# Altium schematic sheet XMOS_TSBOARD_Top.SchDoc
size A3; DocumentNumber: 1; SheetNumber: 1; SheetTotal: 8
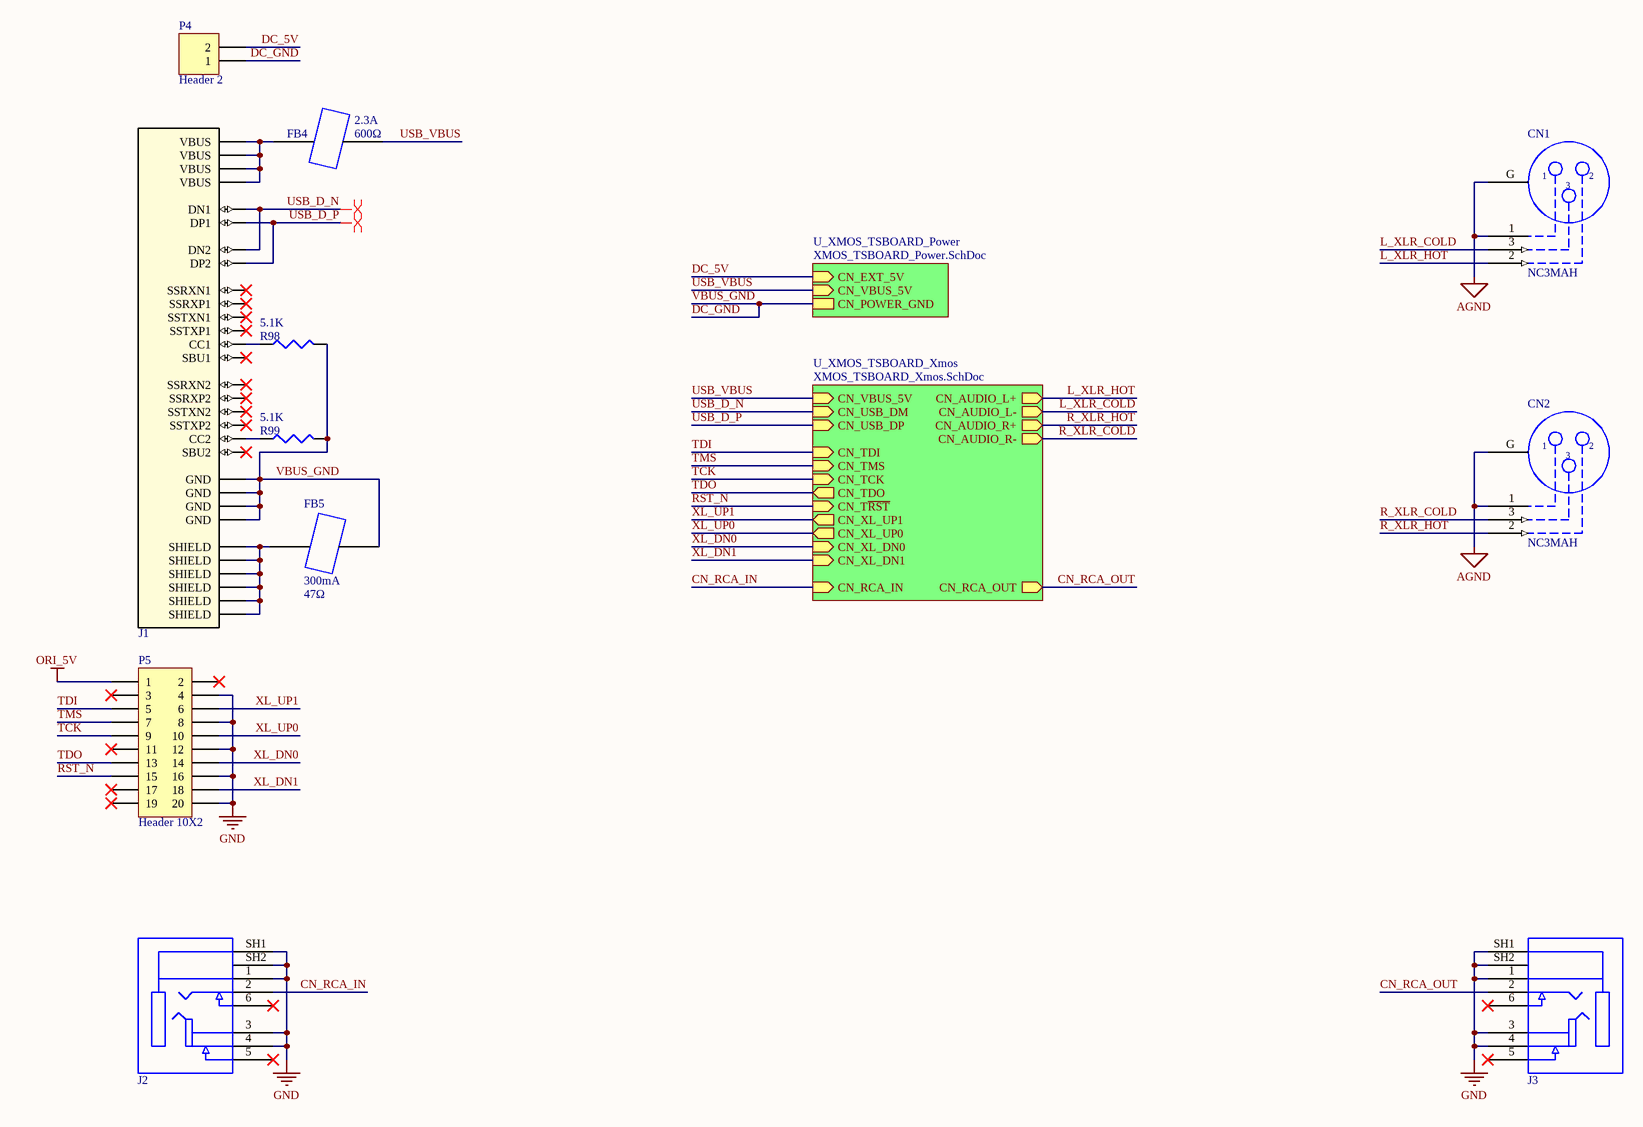
[diagram p0: XMOS_TSBOARD_Top.SchDoc]

## Parts
CN1  NC3MAH  [NC3MAH]
CN2  NC3MAH  [NC3MAH]
FB4  RatedCurrent: 2.3A  Impedance(100MHz): 600Ω  [0805]  (hidden comment: FerriteBeads)
FB5  RatedCurrent: 300mA  Impedance(100MHz): 47Ω  [0603]  (hidden comment: FerriteBeads)
J1  UJ31-CH-G1-SMT-TR  [UJ31-CH-G1-SMT-TR]  (value not drawn)
J2  SJ-3506-SMT-TR  [SJ-3506-SMT-TR]  (value not drawn)
J3  SJ-3506-SMT-TR  [SJ-3506-SMT-TR]  (value not drawn)
P4  Header 2  [HDR1X2]
P5  Header 10X2  [HDR2X10]
R98  value 5.1K  [J1-0603]  (hidden comment: Res3)
R99  value 5.1K  [J1-0603]  (hidden comment: Res3)

## Sub-sheets
U_XMOS_TSBOARD_Power = XMOS_TSBOARD_Power.SchDoc: CN_EXT_5V (in), CN_VBUS_5V (in), CN_POWER_GND
U_XMOS_TSBOARD_Xmos = XMOS_TSBOARD_Xmos.SchDoc: CN_USB_DP (in), CN_USB_DM (in), CN_VBUS_5V (in), CN_TDO (out), CN_TDI (in), CN_TCK (in), CN_TMS (in), CN_T~{RST} (in), CN_AUDIO_L+ (out), CN_AUDIO_L- (out), CN_AUDIO_R+ (out), CN_AUDIO_R- (out), CN_RCA_IN (in), CN_RCA_OUT (out), CN_XL_DN0 (in), CN_XL_DN1 (in), CN_XL_UP0 (out), CN_XL_UP1 (out)

## Nets
AGND: CN1.1 CN1.G CN2.1 CN2.G
GND: J2.1(SLEEVE) J2.3(RING) J2.4(ISOLATED_RING) J2.SH1(SHIELDING) J2.SH2(SHIELDING) J3.1(SLEEVE) J3.3(RING) J3.4(ISOLATED_RING) J3.SH1(SHIELDING) J3.SH2(SHIELDING) P5.4 P5.8 P5.12 P5.16 P5.20
ORI_5V: P5.1
CN_RCA_IN: J2.2(TIP) ; sheet U_XMOS_TSBOARD_Xmos/CN_RCA_IN
CN_RCA_OUT: J3.2(TIP) ; sheet U_XMOS_TSBOARD_Xmos/CN_RCA_OUT
DC_5V: P4.2 ; sheet U_XMOS_TSBOARD_Power/CN_EXT_5V
DC_GND: FB5.1 J1.A1(GND) J1.A12(GND) J1.B1(GND) J1.B12(GND) P4.1 R98.2 R99.2 ; sheet U_XMOS_TSBOARD_Power/CN_POWER_GND  [also labelled VBUS_GND]
L_XLR_COLD: CN1.3 ; sheet U_XMOS_TSBOARD_Xmos/CN_AUDIO_L-
L_XLR_HOT: CN1.2 ; sheet U_XMOS_TSBOARD_Xmos/CN_AUDIO_L+
R_XLR_COLD: CN2.3 ; sheet U_XMOS_TSBOARD_Xmos/CN_AUDIO_R-
R_XLR_HOT: CN2.2 ; sheet U_XMOS_TSBOARD_Xmos/CN_AUDIO_R+
RST_N: P5.15 ; sheet U_XMOS_TSBOARD_Xmos/CN_T~{RST}
TCK: P5.9 ; sheet U_XMOS_TSBOARD_Xmos/CN_TCK
TDI: P5.5 ; sheet U_XMOS_TSBOARD_Xmos/CN_TDI
TDO: P5.13 ; sheet U_XMOS_TSBOARD_Xmos/CN_TDO
TMS: P5.7 ; sheet U_XMOS_TSBOARD_Xmos/CN_TMS
USB_D_N: J1.A7(DN1) J1.B7(DN2) ; sheet U_XMOS_TSBOARD_Xmos/CN_USB_DM
USB_D_P: J1.A6(DP1) J1.B6(DP2) ; sheet U_XMOS_TSBOARD_Xmos/CN_USB_DP
USB_VBUS: FB4.1 ; sheet U_XMOS_TSBOARD_Power/CN_VBUS_5V, sheet U_XMOS_TSBOARD_Xmos/CN_VBUS_5V
XL_DN0: P5.14 ; sheet U_XMOS_TSBOARD_Xmos/CN_XL_DN0
XL_DN1: P5.18 ; sheet U_XMOS_TSBOARD_Xmos/CN_XL_DN1
XL_UP0: P5.10 ; sheet U_XMOS_TSBOARD_Xmos/CN_XL_UP0
XL_UP1: P5.6 ; sheet U_XMOS_TSBOARD_Xmos/CN_XL_UP1
NetFB4_2: FB4.2 J1.A4(VBUS) J1.A9(VBUS) J1.B4(VBUS) J1.B9(VBUS)
NetFB5_2: FB5.2 J1.SH1(SHIELD) J1.SH2(SHIELD) J1.SH3(SHIELD) J1.SH4(SHIELD) J1.SH5(SHIELD) J1.SH6(SHIELD)
NetJ1_A5: J1.A5(CC1) R98.1
NetJ1_B5: J1.B5(CC2) R99.1

Not connected (* = marked no-connect by the designer): J1 A2(SSTXP1)* A3(SSTXN1)* A8(SBU1)* A10(SSRXN2)* A11(SSRXP2)* B2(SSTXP2)* B3(SSTXN2)* B8(SBU2)* B10(SSRXN1)* B11(SSRXP1)*; J2 5(ISOLATED_RING_SWITCH(N-O))* 6(TIP_SWITCH)*; J3 5(ISOLATED_RING_SWITCH(N-O))* 6(TIP_SWITCH)*; P5 2* 3* 11* 17* 19*

## Layout directives
differential pair: USB_D_N, USB_D_P

## Library data of the parts
CN1 CN2 = NC3MAH: 3 pole male XLR receptacle
FB4 = FerriteBeads: Chip Ferrite Beads; DCResistance: 0.06Ω; ManID: BLM21SP601
FB5 = FerriteBeads: Chip Ferrite Beads; DCResistance: 0.55Ω; ManID: BLM18BA470
J1 = UJ31-CH-G1-SMT-TR: USB Type C receptacle
J2 J3 = SJ-3506-SMT-TR: Mid Mount Audio Jack
P4 = Header 2: Header, 2-Pin; LatestRevisionDate: 17-Jul-2002; LatestRevisionNote: Re-released for DXP Platform.; Publisher: Altium Limited
P5 = Header 10X2: Header, 10-Pin, Dual row; LatestRevisionDate: 17-Jul-2002; LatestRevisionNote: Re-released for DXP Platform.; Publisher: Altium Limited
R98 R99 = Res3: Resistor; Published: 8-Jun-2000; LatestRevisionDate: 29-May-2009; LatestRevisionNote: IPC-7351 Footprint Added.; PackageReference: J1-0603; Publisher: Altium Limited; PackageDescription: Chip Resistor